# Altium project controller.PrjPcb
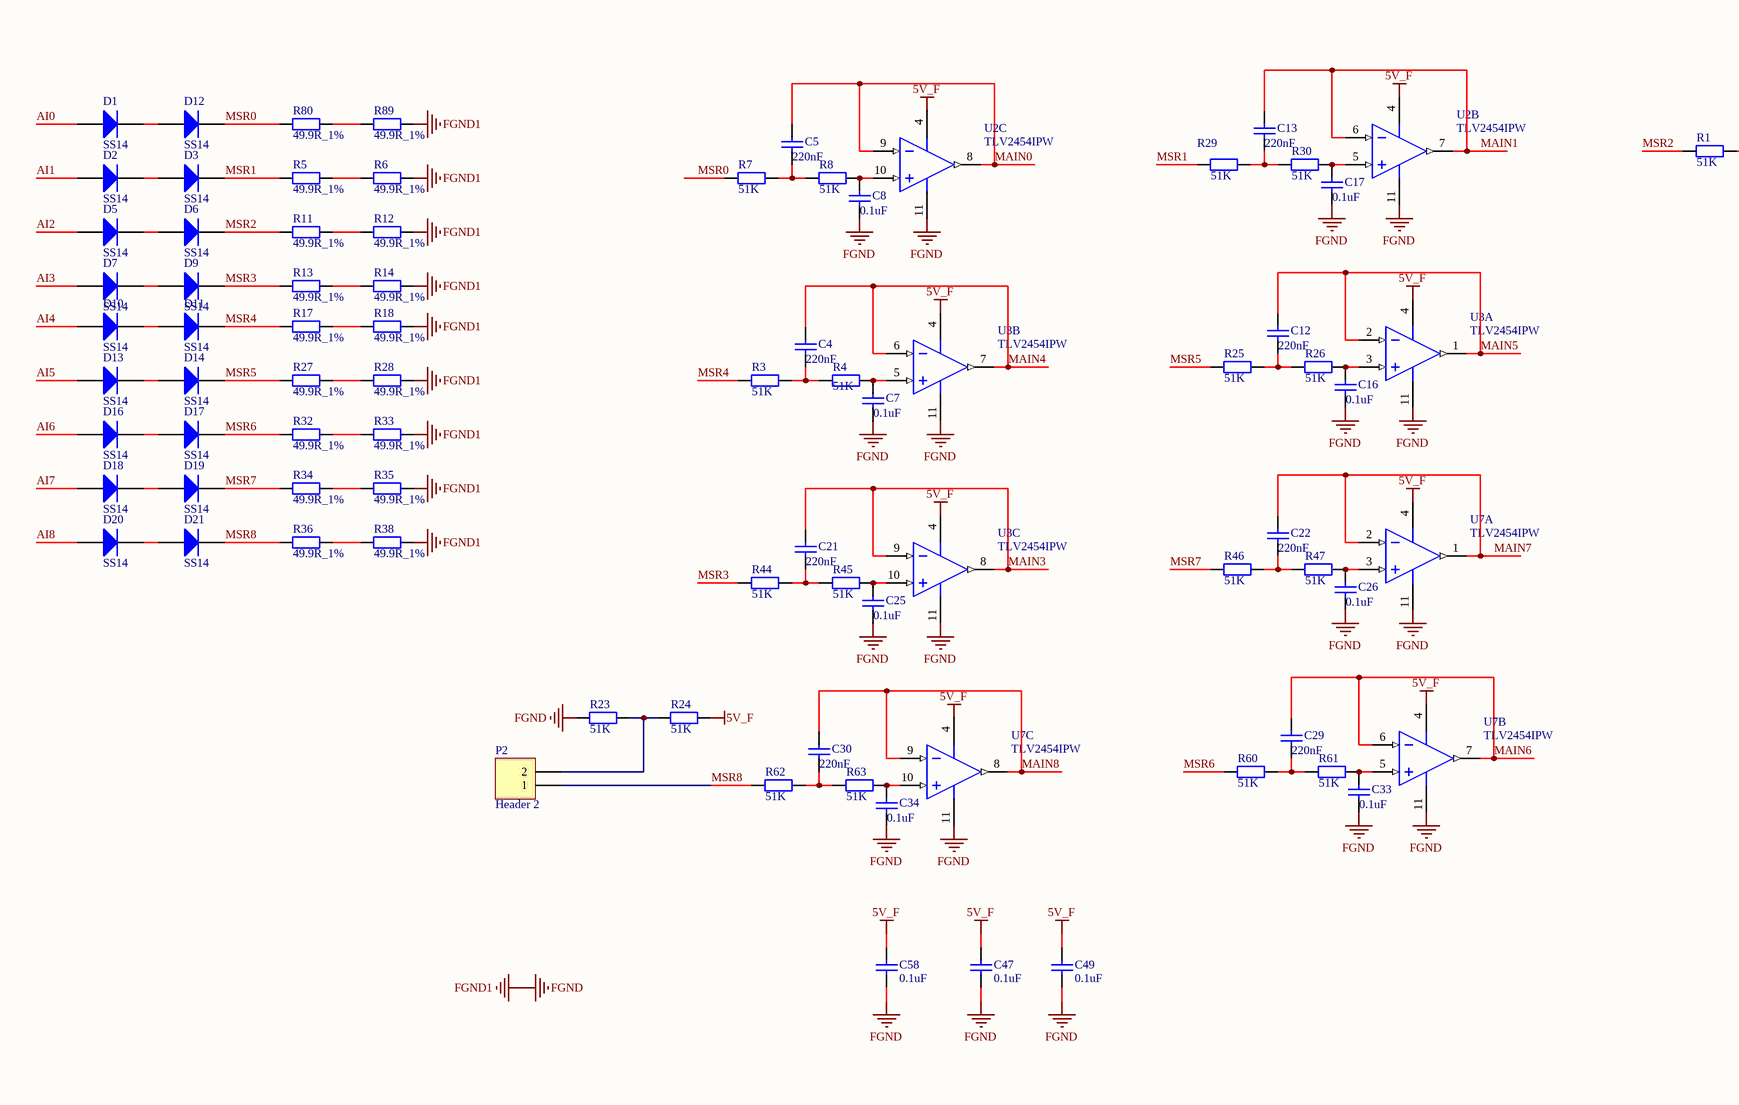
[diagram p0: ai.SchDoc, top left]
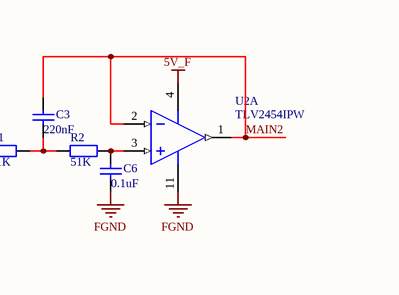
[diagram p1: ai.SchDoc, top right]
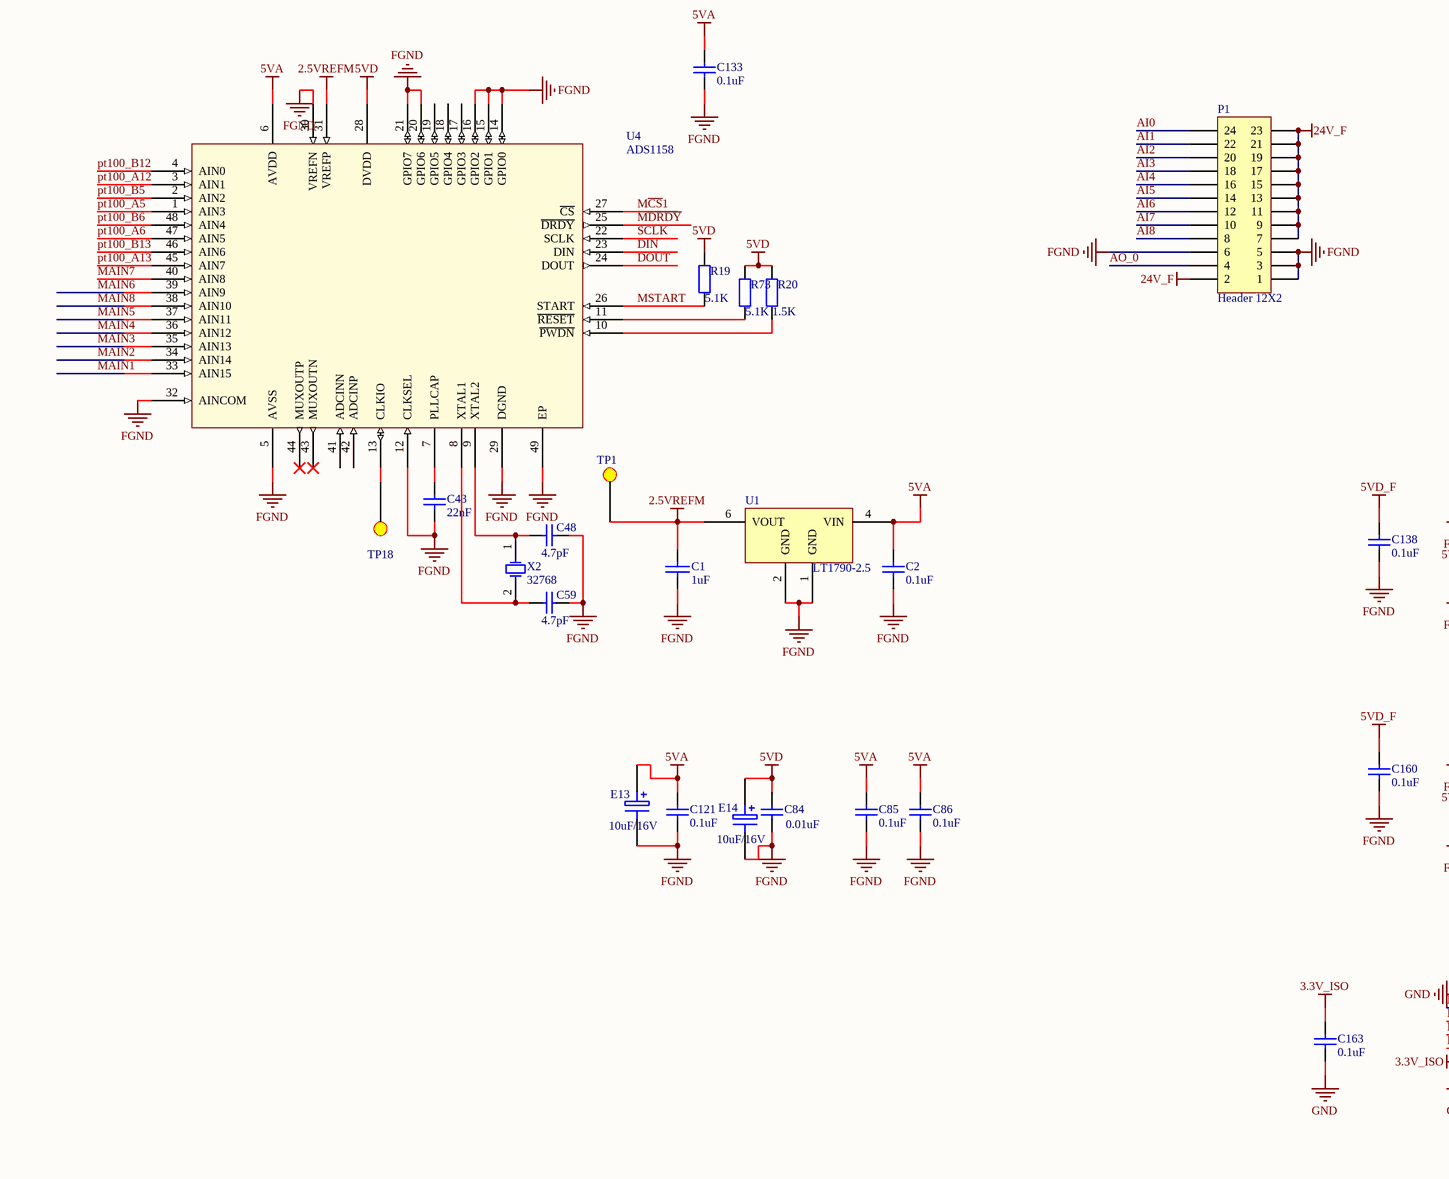
[diagram p2: ai.SchDoc, bottom left]
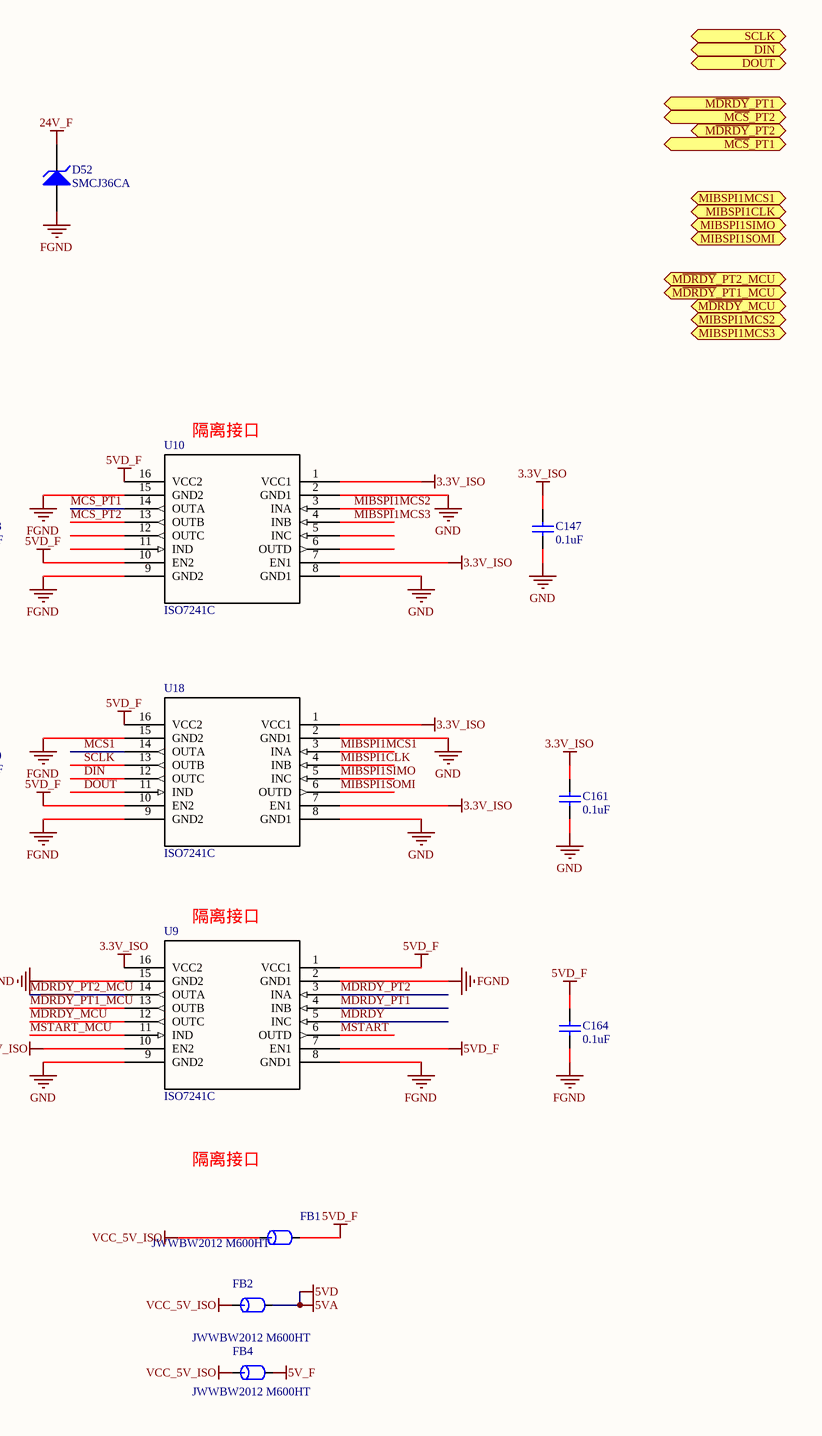
[diagram p3: ai.SchDoc, bottom right]
5 sheets, 231 parts. Net scope: global (net labels, ports and power ports of the same name join across sheets).
Board file: controller_V1.0.PcbDoc
Sheets:
  ai.SchDoc
  ao.SchDoc
  IO_ctrl.SchDoc
  mcu.SchDoc
  pt100.SchDoc

## Sheet ai.SchDoc
size A1

### Parts
C1  1uF  [0603C]
C2  0.1uF  [0603C]
C3  220nF  [0805C]
C4  220nF  [0805C]
C5  220nF  [0805C]
C6  0.1uF  [0603C]
C7  0.1uF  [0603C]
C8  0.1uF  [0603C]
C12  220nF  [0805C]
C13  220nF  [0805C]
C16  0.1uF  [0603C]
C17  0.1uF  [0603C]
C21  220nF  [0805C]
C22  220nF  [0805C]
C25  0.1uF  [0603C]
C26  0.1uF  [0603C]
C29  220nF  [0805C]
C30  220nF  [0805C]
C33  0.1uF  [0603C]
C34  0.1uF  [0603C]
C43  22nF  [0805C]
C47  0.1uF  [0603C]
C48  4.7pF  [0603C]
C49  0.1uF  [0603C]
C58  0.1uF  [0603C]
C59  4.7pF  [0603C]
C84  0.01uF  [0603C]
C85  0.1uF  [0603C]
C86  0.1uF  [0603C]
C121  0.1uF  [0603C]
C133  0.1uF  [0603C]
C138  0.1uF  [0603C]
C147  0.1uF  [0603C]
C160  0.1uF  [0603C]
C161  0.1uF  [0603C]
C163  0.1uF  [0603C]
C164  0.1uF  [0603C]
D1  SS14  [DO-214AC]
D2  SS14  [DO-214AC]
D3  SS14  [DO-214AC]
D5  SS14  [DO-214AC]
D6  SS14  [DO-214AC]
D7  SS14  [DO-214AC]
D9  SS14  [DO-214AC]
D10  SS14  [DO-214AC]
D11  SS14  [DO-214AC]
D12  SS14  [DO-214AC]
D13  SS14  [DO-214AC]
D14  SS14  [DO-214AC]
D16  SS14  [DO-214AC]
D17  SS14  [DO-214AC]
D18  SS14  [DO-214AC]
D19  SS14  [DO-214AC]
D20  SS14  [DO-214AC]
D21  SS14  [DO-214AC]
D52  SMCJ36CA  [SMC]
E13  10uF/16V  [C3528]
E14  10uF/16V  [C3528]
FB1  JWWBW2012 M600HT  [0805R]
FB2  JWWBW2012 M600HT  [0805R]
FB4  JWWBW2012 M600HT  [0805R]
P1  Header 12X2  [XH2.54_2x12]
P2  Header 2  [HDR1X2]
R1  51K  [0603R]
R2  51K  [0603R]
R3  51K  [0603R]
R4  51K  [0603R]
R5  49.9R_1%  [0805R]
R6  49.9R_1%  [0805R]
R7  51K  [0603R]
R8  51K  [0603R]
R11  49.9R_1%  [0805R]
R12  49.9R_1%  [0805R]
R13  49.9R_1%  [0805R]
R14  49.9R_1%  [0805R]
R17  49.9R_1%  [0805R]
R18  49.9R_1%  [0805R]
R19  5.1K  [0603R]
R20  1.5K  [0603R]
R23  51K  [0603R]
R24  51K  [0603R]
R25  51K  [0603R]
R26  51K  [0603R]
R27  49.9R_1%  [0805R]
R28  49.9R_1%  [0805R]
R29  51K  [0603R]
R30  51K  [0603R]
R32  49.9R_1%  [0805R]
R33  49.9R_1%  [0805R]
R34  49.9R_1%  [0805R]
R35  49.9R_1%  [0805R]
R36  49.9R_1%  [0805R]
R38  49.9R_1%  [0805R]
R44  51K  [0603R]
R45  51K  [0603R]
R46  51K  [0603R]
R47  51K  [0603R]
R60  51K  [0603R]
R61  51K  [0603R]
R62  51K  [0603R]
R63  51K  [0603R]
R73  5.1K  [0603R]
R80  49.9R_1%  [0805R]
R89  49.9R_1%  [0805R]
TP1  TEST_POINT  [TPD]  (value not drawn)
TP18  TEST_POINT  [TPD]  (value not drawn)
U1  LT1790-2.5  [SOT23-6]
U2  TLV2454IPW  [TSSOP14]  (parts A,B,C of 4)
U3  TLV2454IPW  [TSSOP14]  (parts A,B,C of 4)
U4  ADS1158  [S-PVFQN-N48]
U7  TLV2454IPW  [TSSOP14]  (parts A,B,C of 4)
U9  ISO7241C  [SOIC16]
U10  ISO7241C  [SOIC16]
U18  ISO7241C  [SOIC16]
X2  32768  [A]

### Ports
DIN (in), DOUT (out), MIBSPI1CLK (in), MIBSPI1MCS1 (in), MIBSPI1MCS2 (in), MIBSPI1MCS3 (in), MIBSPI1SIMO (in), MIBSPI1SOMI (out), M~{CS}_PT1 (out), M~{CS}_PT2 (out), M~{DRDY}_MCU (out), M~{DRDY}_PT1 (out), M~{DRDY}_PT1_MCU (out), M~{DRDY}_PT2 (out), M~{DRDY}_PT2_MCU (out), SCLK (in)

### Nets
2.5VREFM: C1.1 TP1.1 U1.6(VOUT) U4.31(VREFP)
3.3V_ISO: C147.2 C161.2 C163.2 U9.10(EN2) U9.16(VCC2) U10.1(VCC1) U10.7(EN1) U18.1(VCC1) U18.7(EN1)
5V_F: C47.2 C49.2 C58.2 FB4.2 R24.2 U2.4(V+) U3.4(V+) U7.4(V+)
5VA: C2.2 C84.2 C85.2 C86.2 C121.2 C133.2 E13.1 E14.1 FB2.2 R19.1 R20.1 R73.1 U1.4(VIN) U4.6(AVDD) U4.28(DVDD)  [also labelled 5VD]
5VD_F: C138.2 C160.2 C164.2 FB1.2 U9.1(VCC1) U9.7(EN1) U10.10(EN2) U10.16(VCC2) U18.10(EN2) U18.16(VCC2)
24V_F: D52.2(K) P1.2 P1.7 P1.9 P1.11 P1.13 P1.15 P1.17 P1.19 P1.21 P1.23
FGND: C1.2 C2.1 C6.1 C7.1 C8.1 C16.1 C17.1 C25.1 C26.1 C33.1 C34.1 C43.2 C47.1 C48.2 C49.1 C58.1 C59.2 C84.1 C85.1 C86.1 C121.1 C133.1 C138.1 C160.1 C164.1 D52.1(A) E13.2 E14.2 P1.1 P1.3 P1.5 P1.6 R6.1 R12.1 R14.1 R18.1 R23.1 R28.1 R33.1 R35.1 R38.1 R89.1 U1.1(GND) U1.2(GND) U2.11(GND) U3.11(GND) U4.5(AVSS) U4.12(CLKSEL) U4.14(GPIO0) U4.15(GPIO1) U4.16(GPIO2) U4.20(GPIO6) U4.21(GPIO7) U4.29(DGND) U4.30(VREFN) U4.32(AINCOM) U4.49(EP) U7.11(GND) U9.2(GND1) U9.8(GND1) U10.9(GND2) U10.15(GND2) U18.9(GND2) U18.15(GND2)  [also labelled FGND1]
GND: C147.1 C161.1 C163.1 U9.9(GND2) U9.15(GND2) U10.2(GND1) U10.8(GND1) U18.2(GND1) U18.8(GND1)
VCC_5V_ISO: FB1.1 FB2.1 FB4.1
AI0: D1.1(A) P1.24
AI1: D2.1(A) P1.22
AI2: D5.1(A) P1.20
AI3: D7.1(A) P1.18
AI4: D10.1(A) P1.16
AI5: D13.1(A) P1.14
AI6: D16.1(A) P1.12
AI7: D18.1(A) P1.10
AI8: D20.1(A) P1.8
AO_0: P1.4
DIN: U4.23(DIN) U18.12(OUTC)
DOUT: U4.24(DOUT) U18.11(IND)
MAIN0: C5.2 U2.8(OUT) U2.9(IN-)
MAIN1: C13.2 U2.6(IN-) U2.7(OUT) U4.33(AIN15)
MAIN2: C3.2 U2.1(OUT) U2.2(IN-) U4.34(AIN14)
MAIN3: C21.2 U3.8(OUT) U3.9(IN-) U4.35(AIN13)
MAIN4: C4.2 U3.6(IN-) U3.7(OUT) U4.36(AIN12)
MAIN5: C12.2 U3.1(OUT) U3.2(IN-) U4.37(AIN11)
MAIN6: C29.2 U4.39(AIN9) U7.6(IN-) U7.7(OUT)
MAIN7: C22.2 U4.40(AIN8) U7.1(OUT) U7.2(IN-)
MAIN8: C30.2 U4.38(AIN10) U7.8(OUT) U7.9(IN-)
M~{CS}1: U4.27(~{CS}) U18.14(OUTA)
M~{CS}_PT1: U10.14(OUTA)
M~{CS}_PT2: U10.13(OUTB)
M~{DRDY}: U4.25(~{DRDY}) U9.5(INC)
M~{DRDY}_MCU: U9.12(OUTC)
M~{DRDY}_PT1: U9.4(INB)
M~{DRDY}_PT1_MCU: U9.13(OUTB)
M~{DRDY}_PT2: U9.3(INA)
M~{DRDY}_PT2_MCU: U9.14(OUTA)
MIBSPI1CLK: U18.4(INB)
MIBSPI1MCS1: U18.3(INA)
MIBSPI1MCS2: U10.3(INA)
MIBSPI1MCS3: U10.4(INB)
MIBSPI1SIMO: U18.5(INC)
MIBSPI1SOMI: U18.6(OUTD)
MSR0: D12.2(K) R7.2 R80.2
MSR1: D3.2(K) R5.2 R29.2
MSR2: D6.2(K) R1.2 R11.2
MSR3: D9.2(K) R13.2 R44.2
MSR4: D11.2(K) R3.2 R17.2
MSR5: D14.2(K) R25.2 R27.2
MSR6: D17.2(K) R32.2 R60.2
MSR7: D19.2(K) R34.2 R46.2
MSR8: D21.2(K) P2.1 R36.2 R62.2
MSTART: R19.2 U4.26(START) U9.6(OUTD)
MSTART_MCU: U9.11(IND)
pt100_A5: U4.1(AIN3)
pt100_A6: U4.47(AIN5)
pt100_A12: U4.3(AIN1)
pt100_A13: U4.45(AIN7)
pt100_B5: U4.2(AIN2)
pt100_B6: U4.48(AIN4)
pt100_B12: U4.4(AIN0)
pt100_B13: U4.46(AIN6)
SCLK: U4.22(SCLK) U18.13(OUTB)
NetC3_1: C3.1 R1.1 R2.2
NetC4_1: C4.1 R3.1 R4.2
NetC5_1: C5.1 R7.1 R8.2
NetC6_2: C6.2 R2.1 U2.3(IN+)
NetC7_2: C7.2 R4.1 U3.5(IN+)
NetC8_2: C8.2 R8.1 U2.10(IN+)
NetC12_1: C12.1 R25.1 R26.2
NetC13_1: C13.1 R29.1 R30.2
NetC16_2: C16.2 R26.1 U3.3(IN+)
NetC17_2: C17.2 R30.1 U2.5(IN+)
NetC21_1: C21.1 R44.1 R45.2
NetC22_1: C22.1 R46.1 R47.2
NetC25_2: C25.2 R45.1 U3.10(IN+)
NetC26_2: C26.2 R47.1 U7.3(IN+)
NetC29_1: C29.1 R60.1 R61.2
NetC30_1: C30.1 R62.1 R63.2
NetC33_2: C33.2 R61.1 U7.5(IN+)
NetC34_2: C34.2 R63.1 U7.10(IN+)
NetC43_1: C43.1 U4.7(PLLCAP)
NetC48_1: C48.1 U4.9(XTAL2) X2.1(OSC1)
NetC59_1: C59.1 U4.8(XTAL1) X2.2(OSC2)
NetD1_2: D1.2(K) D12.1(A)
NetD2_2: D2.2(K) D3.1(A)
NetD5_2: D5.2(K) D6.1(A)
NetD7_2: D7.2(K) D9.1(A)
NetD10_2: D10.2(K) D11.1(A)
NetD13_2: D13.2(K) D14.1(A)
NetD16_2: D16.2(K) D17.1(A)
NetD18_2: D18.2(K) D19.1(A)
NetD20_2: D20.2(K) D21.1(A)
NetP2_2: P2.2 R23.2 R24.1
NetR5_1: R5.1 R6.2
NetR11_1: R11.1 R12.2
NetR13_1: R13.1 R14.2
NetR17_1: R17.1 R18.2
NetR20_2: R20.2 U4.10(~{PWDN})
NetR27_1: R27.1 R28.2
NetR32_1: R32.1 R33.2
NetR34_1: R34.1 R35.2
NetR36_1: R36.1 R38.2
NetR73_2: R73.2 U4.11(~{RESET})
NetR80_1: R80.1 R89.2
NetTP18_1: TP18.1 U4.13(CLKIO)

Not connected (* = marked no-connect by the designer): U1 3(DNC) 5(DNC); U4 17(GPIO3) 18(GPIO4) 19(GPIO5) 41(ADCINN) 42(ADCINP) 43(MUXOUTN)* 44(MUXOUTP)*; U10 5(INC) 6(OUTD) 11(IND) 12(OUTC)

### Notes on the sheet
- (near U10) 隔离接口
- (near U9) 隔离接口
- 隔离接口

### Library data of the parts
C1 = CAP: Capacitor
C2-C8 C12 C13 C16 C17 C21 C22 C25 C26 C29 C30 C33 C34 C43 C47-C49 C58 C84-C86 C121 C133 C138 C147 C160 C161 C163 C164 = Cap: Capacitor; Published: 8-Jun-2000; LatestRevisionDate: 17-Jul-2002; LatestRevisionNote: Re-released for DXP Platform.; PackageReference: RAD-0.3; Publisher: Altium Limited; PackageDescription: Radial Cap, Thru-Hole; 2 Leads; 0.3 in Pin Spacing
  C2 C47 C49 C58 C85 C86 C121 C133 C138 C147 C160 C161 C163 C164: Value: 0.1uF
C59 = Cap: Capacitor; Value: 6.8pF; Published: 8-Jun-2000; LatestRevisionDate: 17-Jul-2002; LatestRevisionNote: Re-released for DXP Platform.; PackageReference: RAD-0.3; Publisher: Altium Limited; PackageDescription: Radial Cap, Thru-Hole; 2 Leads; 0.3 in Pin Spacing
D1-D3 D5-D7 D9-D14 D16-D21 = Diode: Default Diode; Published: 8-Jun-2000; LatestRevisionDate: 17-Jul-2002; LatestRevisionNote: Re-released for DXP Platform.; PackageVersion: Sep-1996; PackageReference: SMC; Publisher: Altium Limited; Code_JEDEC: DO-214-AB
D52 = D Zener: SMBJ36CA; Published: 8-Jun-2000; LatestRevisionDate: 17-Jul-2002; LatestRevisionNote: Re-released for DXP Platform.; PackageReference: DIODE-0.7; Publisher: Altium Limited
E13 E14 = ELECTRO1: Electrolytic Capacitor
FB1 FB2 FB4 = FB: Part Field 1: 磁珠/0603/1K ohm/100MHz; FB: BLM18BD102SN1(muRata); Text Field1: FB
P1 = Header 12X2: Header, 12-Pin, Dual row; LatestRevisionDate: 17-Jul-2002; LatestRevisionNote: Re-released for DXP Platform.; Publisher: Altium Limited
P2 = Header 2: Header, 2-Pin; LatestRevisionDate: 17-Jul-2002; LatestRevisionNote: Re-released for DXP Platform.; Publisher: Altium Limited
R1-R8 R11-R14 R17-R20 R23-R30 R32-R36 R38 R44-R47 R60-R63 R73 R80 R89 = Res0805M
U1 = LT1790-2.5: 2.5V Micropower SOT-23  Low Dropout Reference
U2 U3 U7 = MAX908EPD: Quad High-speed, Ultra Low-power, Single-Supply TTL comparator; Published: 16-Jan-2001; LatestRevisionDate: 29-May-2009; LatestRevisionNote: Component Body Added.; DatasheetVersion: Jul-1994; PackageVersion: RevB, 21-0043; PackageReference: PD14; Publisher: Altium Limited; PackageDescription: DIP, 14-Pin, Row Spacing 7.62 mm, Pitch 2.54 mm; Code_JEDEC: MS-001-AC; ComponentLink1Description: Manufacturer Link; ComponentLink1URL: http://www.maxim-ic.com/; ComponentLink2Description: Datasheet; ComponentLink2URL: http://pdfserv.maxim-ic.com/en/ds/MAX907-MAX909.pdf
U4 = ADS1158: 16-Channel, 16-Bit Analog-to-Digital Converter
X2 = XTAL: Crystal Oscillator; Published: 8-Jun-2000; LatestRevisionDate: 17-Jul-2002; LatestRevisionNote: Re-released for DXP Platform.; PackageReference: R38; Publisher: Altium Limited

## Sheet ao.SchDoc
size A3
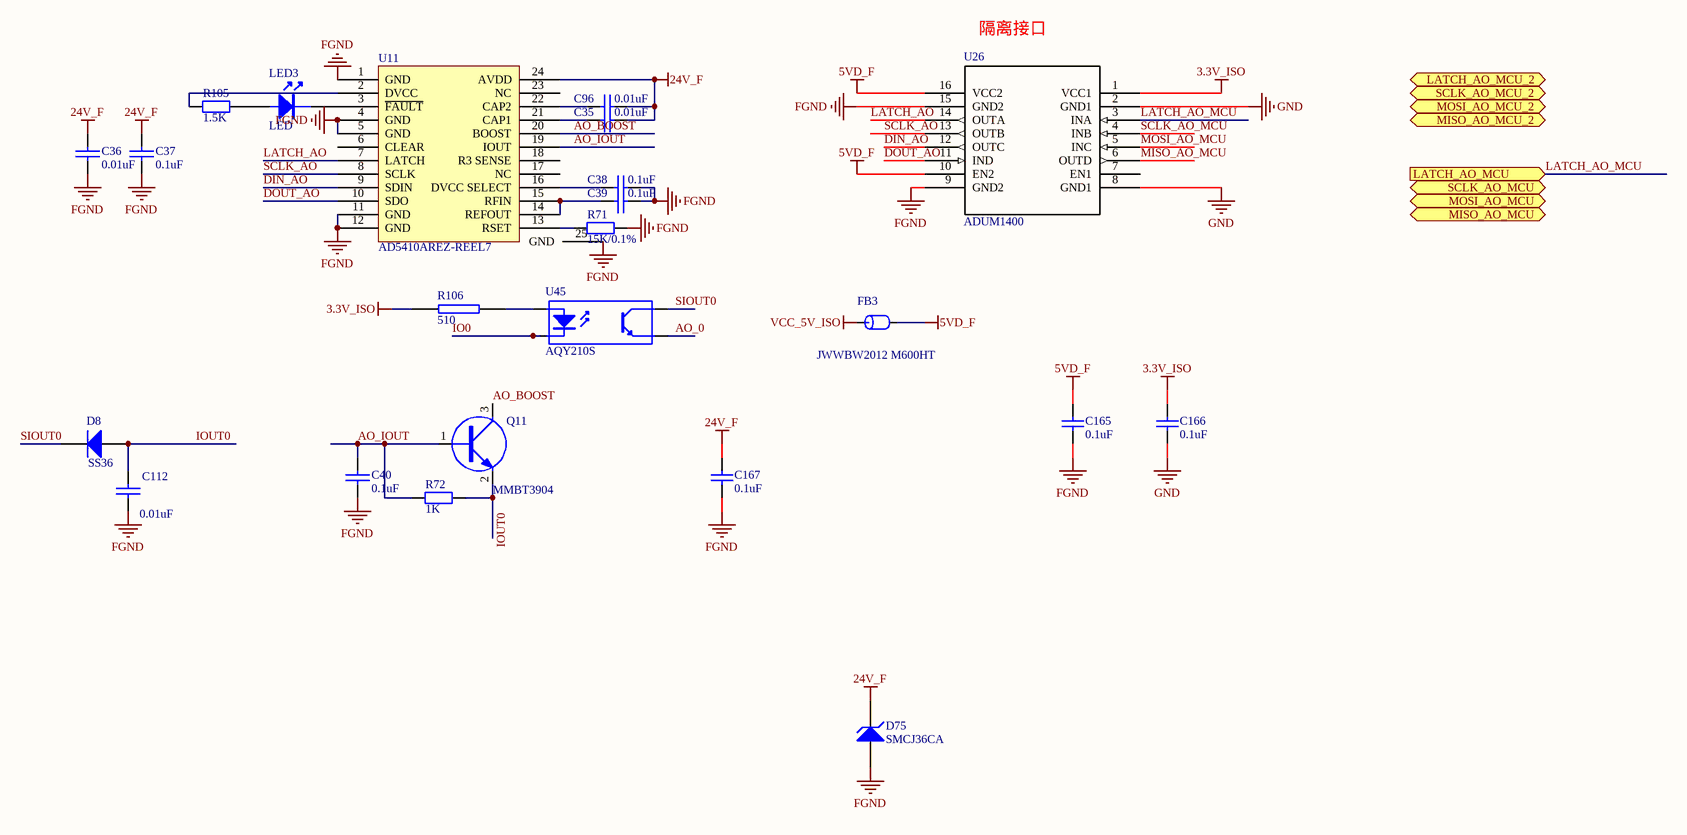
[diagram p4: ao.SchDoc]

### Parts
C35  0.01uF  [0603C]
C36  0.01uF  [0603C]
C37  0.1uF  [0603C]
C38  0.1uF  [0603C]
C39  0.1uF  [0603C]
C40  0.1uF  [0603C]
C96  0.01uF  [0603C]
C112  0.01uF  [0603C]
C165  0.1uF  [0603C]
C166  0.1uF  [0603C]
C167  0.1uF  [0603C]
D8  SS36  [sma]
D75  SMCJ36CA  [SMC]
FB3  JWWBW2012 M600HT  [0805R]
LED3  LED  [0603LED]
Q11  MMBT3904  [SOT23-3]
R71  15K/0.1%  [0603R]
R72  1K  [0603R]
R105  1.5K  [0603R]
R106  510  [0603R]
U11  AD5410AREZ-REEL7  [AD5410AREZ-REEL7]
U26  ADUM1400  [SOIC16]
U45  AQY210S  [sop4]

### Ports
LATCH_AO_MCU (in), LATCH_AO_MCU_2 (in), MISO_AO_MCU (out), MISO_AO_MCU_2 (out), MOSI_AO_MCU (in), MOSI_AO_MCU_2 (in), SCLK_AO_MCU (in), SCLK_AO_MCU_2 (in)

### Nets
3.3V_ISO: C166.2 R106.2 U26.1(VCC1)
5VD_F: C165.2 FB3.2 U26.10(EN2) U26.16(VCC2)
24V_F: C35.2 C36.2 C37.2 C96.2 C167.2 D75.2(K) U11.24(AVDD)
FGND: C36.1 C37.1 C38.2 C39.2 C40.1 C112.1 C165.1 C167.1 D75.1(A) R71.2 U11.1(GND) U11.4(GND) U11.5(GND) U11.11(GND) U11.12(GND) U11.25(GND) U26.9(GND2) U26.15(GND2)
GND: C166.1 U26.2(GND1) U26.8(GND1)
VCC_5V_ISO: FB3.1
AO_0: U45.3(E)
AO_BOOST: Q11.3(C) U11.20(BOOST)
AO_IOUT: C40.2 Q11.1(B) R72.1 U11.19(IOUT)
DIN_AO: U11.9(SDIN) U26.12(OUTC)
DOUT_AO: U11.10(SDO) U26.11(IND)
IO0: U45.2(K)
IOUT0: C112.2 D8.1(A) Q11.2(E) R72.2
LATCH_AO: U11.7(LATCH) U26.14(OUTA)
LATCH_AO_MCU: U26.3(INA) ; port LATCH_AO_MCU
MISO_AO_MCU: U26.6(OUTD)
MOSI_AO_MCU: U26.5(INC)
SCLK_AO: U11.8(SCLK) U26.13(OUTB)
SCLK_AO_MCU: U26.4(INB)
SIOUT0: D8.2(K) U45.4(C)
NetC35_1: C35.1 U11.21(CAP1)
NetC38_1: C38.1 U11.16(DVCC_SELECT)
NetC39_1: C39.1 U11.14(REFOUT) U11.15(RFIN)
NetC96_1: C96.1 U11.22(CAP2)
NetLED3_1: LED3.1 R105.2
NetLED3_2: LED3.2 U11.3(~{FAULT})
NetR71_1: R71.1 U11.13(RSET)
NetR105_1: R105.1 U11.2(DVCC)
NetR106_1: R106.1 U45.1(A)

Not connected (* = marked no-connect by the designer): U11 6(CLEAR) 17(NC) 18(R3_SENSE) 23(NC); U26 7(EN1)

### Notes on the sheet
- 隔离接口

### Library data of the parts
C35-C40 C96 C112 = CAP: Capacitor
C165-C167 = Cap: Capacitor; Published: 8-Jun-2000; LatestRevisionDate: 17-Jul-2002; LatestRevisionNote: Re-released for DXP Platform.; PackageReference: RAD-0.3; Publisher: Altium Limited; PackageDescription: Radial Cap, Thru-Hole; 2 Leads; 0.3 in Pin Spacing; Value: 0.1uF
D8 = Diode 1N4001: 1 Amp General Purpose Rectifier; Published: 8-Jun-2000; LatestRevisionDate: 17-Jul-2002; LatestRevisionNote: Re-released for DXP Platform.; DatasheetVersion: 1998; PackageVersion: Aug-1999; PackageReference: DO-41; Publisher: Altium Limited; Code_JEDEC: DO-204-AL; ComponentLink1Description: Manufacturer Link; ComponentLink1URL: http://www.fairchildsemi.com/; ComponentLink2Description: Datasheet; ComponentLink2URL: http://www.fairchildsemi.com/ds/1N%2F1N4001.pdf
D75 = D Zener: SMBJ36CA; Published: 8-Jun-2000; LatestRevisionDate: 17-Jul-2002; LatestRevisionNote: Re-released for DXP Platform.; PackageReference: DIODE-0.7; Publisher: Altium Limited
FB3 = FB: as FB1 on sheet ai; Text Field1: FB
Q11 = NPN_MMBT3904
R71 R72 R105 = Res0805M
R106 = RES2
U26 = ISO7241C
U45 = Optoisolator1: 4-Pin Phototransistor Optocoupler; Published: 24-Mar-1999; LatestRevisionDate: 04-Mar-2005; LatestRevisionNote: Sch pins 3 & 4 Swapped.; DatasheetVersion: Nov-2003; PackageReference: DIP-4; Publisher: Altium Limited

## Sheet IO_ctrl.SchDoc
size A3
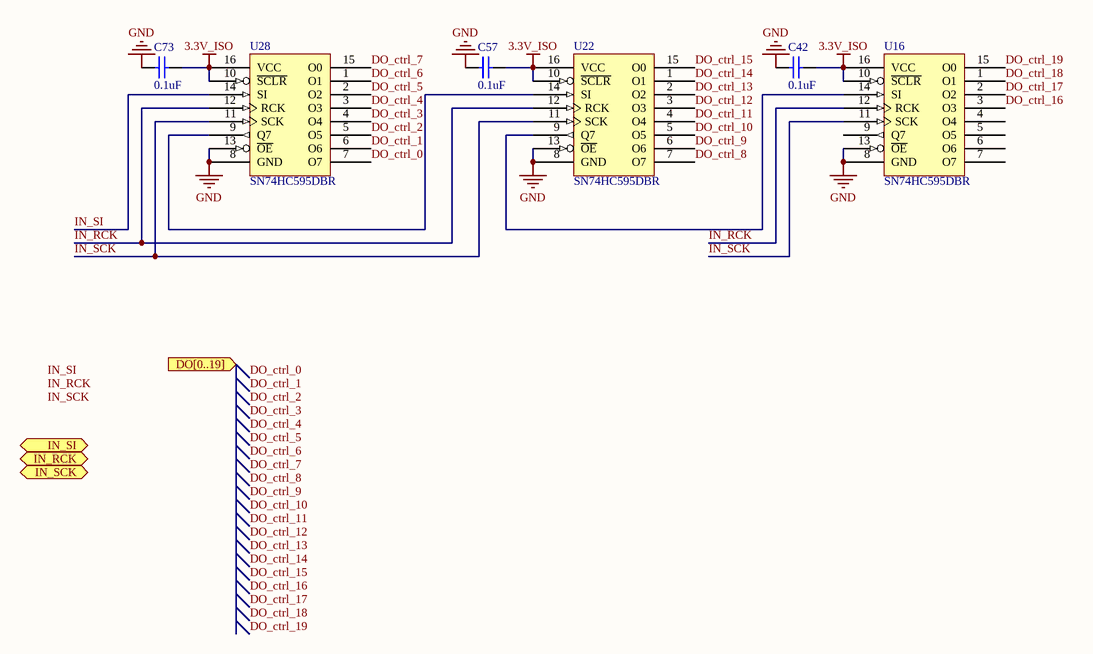
[diagram p5: IO_ctrl.SchDoc]

### Parts
C42  0.1uF  [0603C]
C57  0.1uF  [0603C]
C73  0.1uF  [0603C]
U16  SN74HC595DBR  [SSOP16]
U22  SN74HC595DBR  [SSOP16]
U28  SN74HC595DBR  [SSOP16]

### Ports
DO[0..19] (in), IN_RCK (in), IN_SCK (in), IN_SI (in)

### Nets
3.3V_ISO: C42.1 C57.1 C73.1 U16.10(~{SCLR}) U16.16(VCC) U22.10(~{SCLR}) U22.16(VCC) U28.10(~{SCLR}) U28.16(VCC)
GND: C42.2 C57.2 C73.2 U16.8(GND) U16.13(~{OE}) U22.8(GND) U22.13(~{OE}) U28.8(GND) U28.13(~{OE})
DO_ctrl_0: U28.7(O7)
DO_ctrl_1: U28.6(O6)
DO_ctrl_2: U28.5(O5)
DO_ctrl_3: U28.4(O4)
DO_ctrl_4: U28.3(O3)
DO_ctrl_5: U28.2(O2)
DO_ctrl_6: U28.1(O1)
DO_ctrl_7: U28.15(O0)
DO_ctrl_8: U22.7(O7)
DO_ctrl_9: U22.6(O6)
DO_ctrl_10: U22.5(O5)
DO_ctrl_11: U22.4(O4)
DO_ctrl_12: U22.3(O3)
DO_ctrl_13: U22.2(O2)
DO_ctrl_14: U22.1(O1)
DO_ctrl_15: U22.15(O0)
DO_ctrl_16: U16.3(O3)
DO_ctrl_17: U16.2(O2)
DO_ctrl_18: U16.1(O1)
DO_ctrl_19: U16.15(O0)
IN_RCK: U16.12(RCK) U22.12(RCK) U28.12(RCK)
IN_SCK: U16.11(SCK) U22.11(SCK) U28.11(SCK)
IN_SI: U28.14(SI)
NetU16_14: U16.14(SI) U22.9(Q7)
NetU22_14: U22.14(SI) U28.9(Q7)

Not connected (* = marked no-connect by the designer): U16 4(O4) 5(O5) 6(O6) 7(O7) 9(Q7)

### Notes on the sheet
- Labels drawn without touching a wire or pin: DO_ctrl_0, DO_ctrl_1, DO_ctrl_2, DO_ctrl_3, DO_ctrl_4, DO_ctrl_5, DO_ctrl_6, DO_ctrl_7, DO_ctrl_8, DO_ctrl_9, DO_ctrl_10, DO_ctrl_11, DO_ctrl_12, DO_ctrl_13, DO_ctrl_14, DO_ctrl_15, DO_ctrl_16, DO_ctrl_17, DO_ctrl_18, DO_ctrl_19, IN_RCK, IN_SCK, IN_SI

### Library data of the parts
C42 C57 C73 = Cap: Capacitor; Published: 8-Jun-2000; LatestRevisionDate: 17-Jul-2002; LatestRevisionNote: Re-released for DXP Platform.; PackageReference: RAD-0.3; Publisher: Altium Limited; PackageDescription: Radial Cap, Thru-Hole; 2 Leads; 0.3 in Pin Spacing; Value: 0.1uF
U16 U22 U28 = 74HC595

## Sheet mcu.SchDoc
size A3
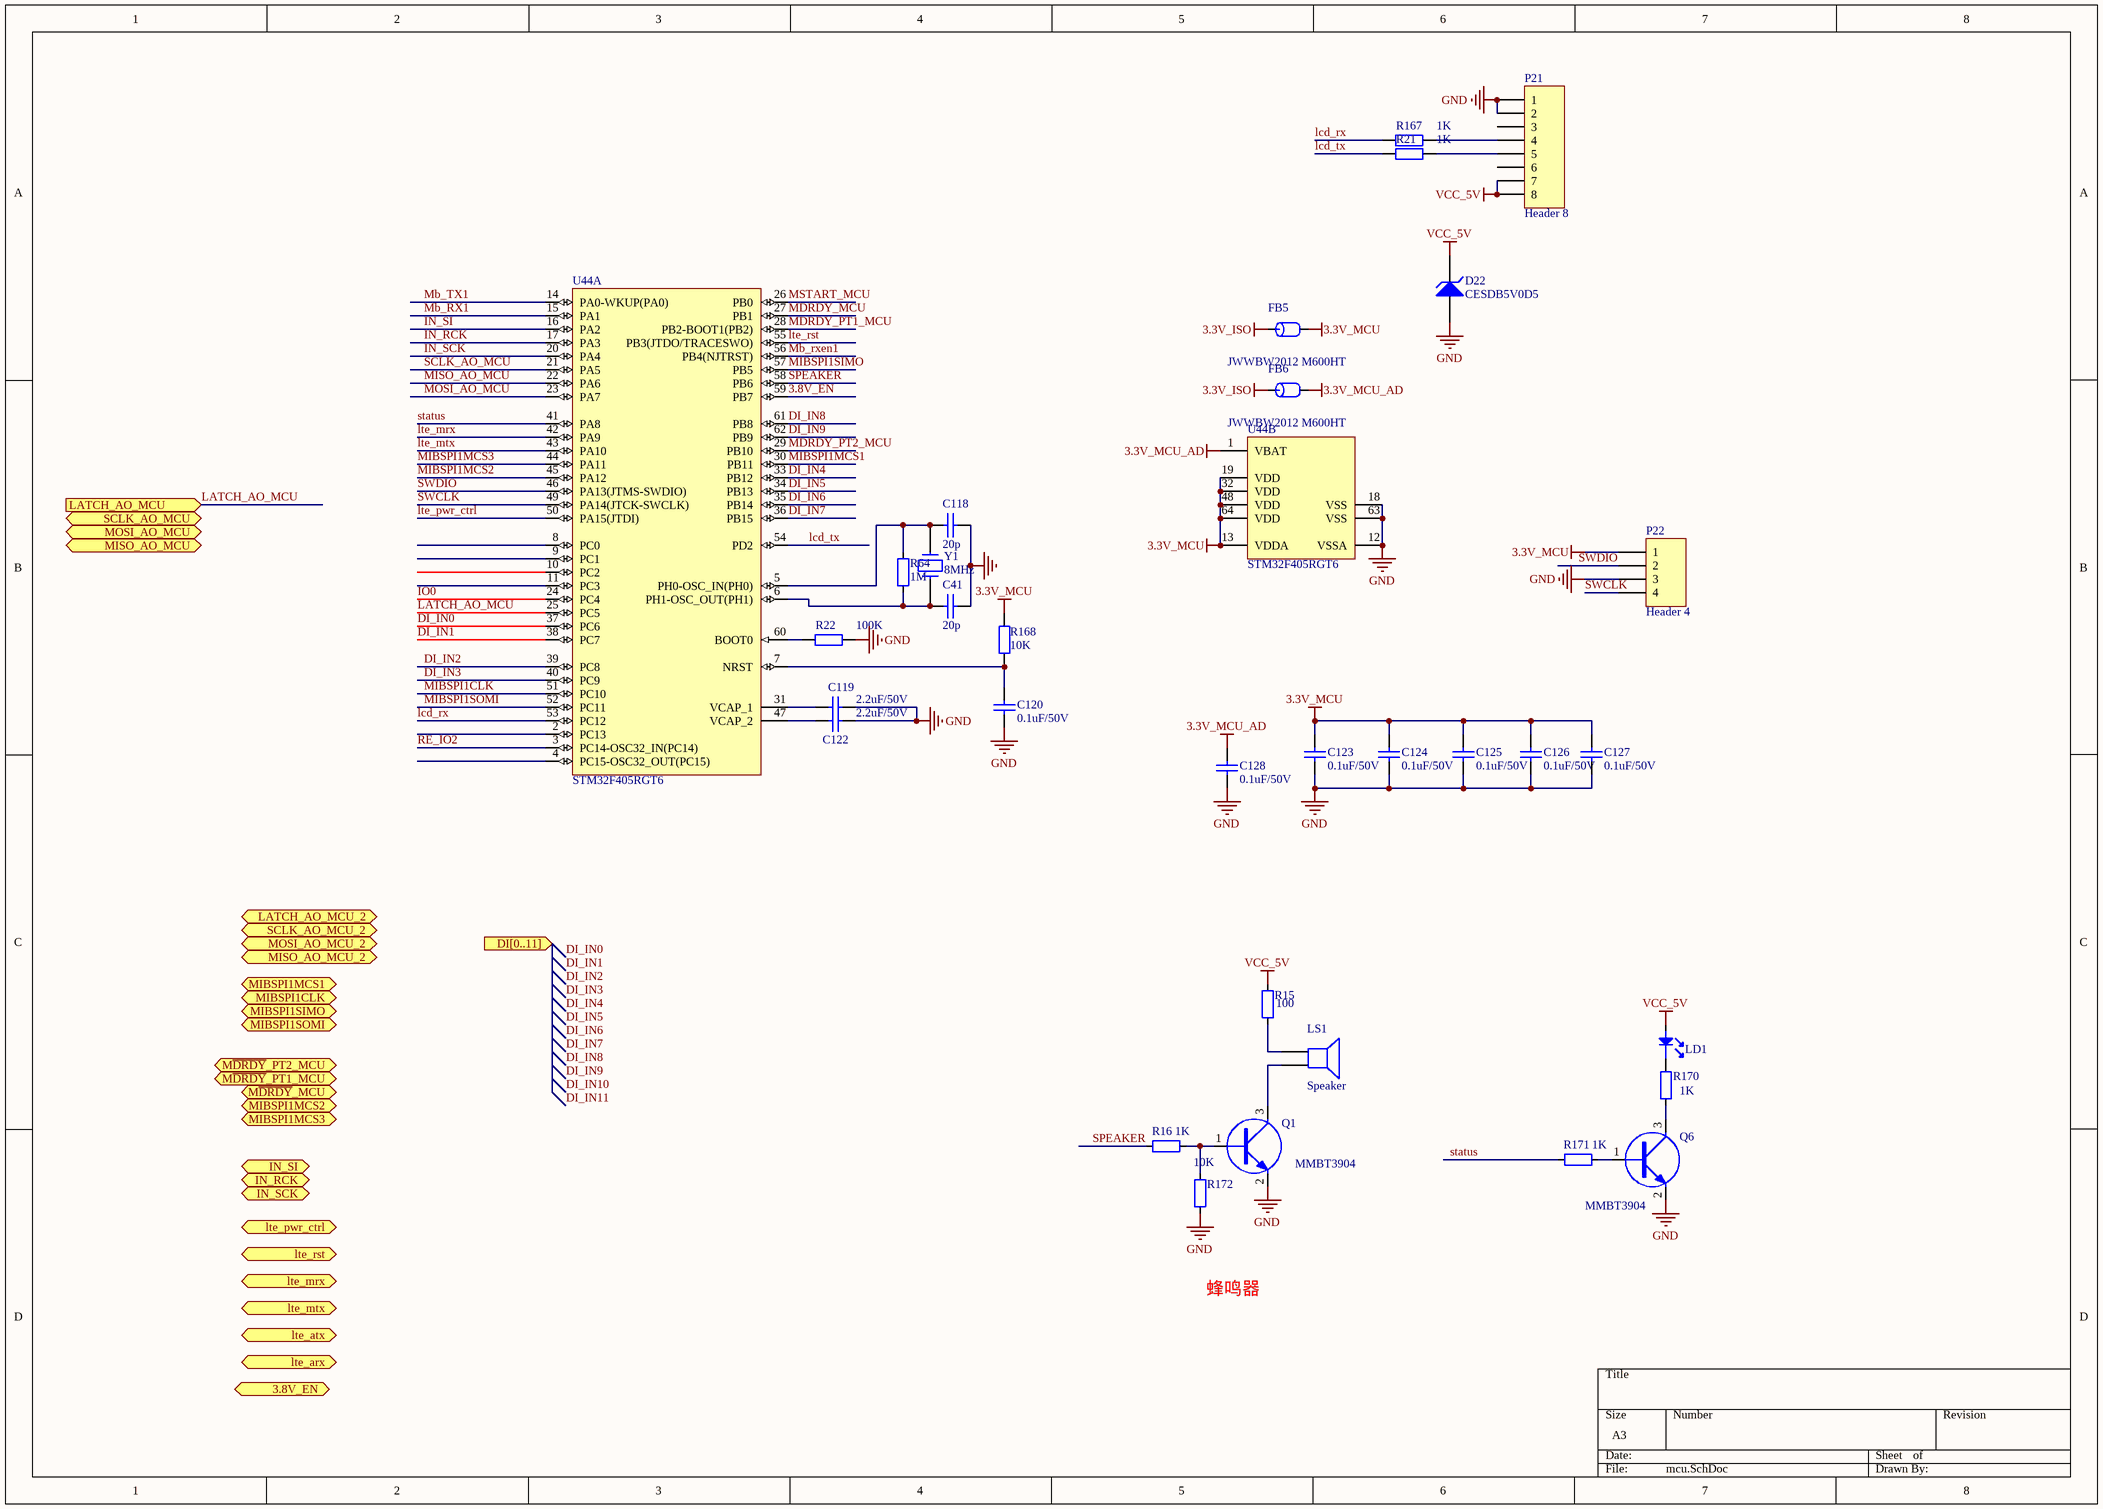
[diagram p6: mcu.SchDoc]

### Parts
C41  20p  [0603c]
C118  20p  [0603c]
C119  2.2uF/50V  [0603C]
C120  0.1uF/50V  [0603C]
C122  2.2uF/50V  [0603C]
C123  0.1uF/50V  [0603C]
C124  0.1uF/50V  [0603C]
C125  0.1uF/50V  [0603C]
C126  0.1uF/50V  [0603C]
C127  0.1uF/50V  [0603C]
C128  0.1uF/50V  [0603C]
D22  CESDB5V0D5  [sod323]
FB5  JWWBW2012 M600HT  [0805R]
FB6  JWWBW2012 M600HT  [0805R]
LD1  LED_Green_19-217  [0603led]  (value not drawn)
LS1  Speaker  [BUFFER_0905]
P21  Header 8  [2.0x8]
P22  Header 4  [HDR1X4]
Q1  MMBT3904  [SOT23-3]
Q6  MMBT3904  [SOT23-3]
R15  100  [0603R]
R16  1K  [0603r]
R21  1K  [0603R]
R22  100K  [0603R]
R64  1M  [0603R]
R167  1K  [0603R]
R168  10K  [0603R]
R170  1K  [0603r]
R171  1K  [0603r]
R172  10K  [0603r]
U44  STM32F405RGT6  [LQFP-64]  (parts A,B of 2)
Y1  8MHz  [CRAY_5032]

### Ports
3.8V_EN (out), DI[0..11] (in), IN_RCK (out), IN_SCK (out), IN_SI (out), LATCH_AO_MCU (in), LATCH_AO_MCU_2 (out), lte_arx (out), lte_atx (in), lte_mrx (out), lte_mtx (in), lte_pwr_ctrl (out), lte_rst (out), MIBSPI1CLK (in), MIBSPI1MCS1 (in), MIBSPI1MCS2 (in), MIBSPI1MCS3 (in), MIBSPI1SIMO (in), MIBSPI1SOMI (out), MISO_AO_MCU (out), MISO_AO_MCU_2 (in), MOSI_AO_MCU (in), MOSI_AO_MCU_2 (out), M~{DRDY}_MCU (out), M~{DRDY}_PT1_MCU (in), M~{DRDY}_PT2_MCU (in), SCLK_AO_MCU (in), SCLK_AO_MCU_2 (out)

### Nets
3.3V_ISO: FB5.1 FB6.1
3.3V_MCU: C123.2 C124.2 C125.2 C126.2 C127.2 FB5.2 P22.1 R168.2 U44.13(VDDA) U44.19(VDD) U44.32(VDD) U44.48(VDD) U44.64(VDD)
3.3V_MCU_AD: C128.2 FB6.2 U44.1(VBAT)
GND: C41.1 C118.1 C119.1 C120.1 C122.1 C123.1 C124.1 C125.1 C126.1 C127.1 C128.1 D22.1(A) P21.1 P21.2 P22.3 Q1.2(E) Q6.2(E) R22.2 R172.2 U44.12(VSSA) U44.18(VSS) U44.63(VSS)
VCC_5V: D22.2(K) LD1.1 P21.7 P21.8 R15.1
3.8V_EN: U44.59(PB7)
DI_IN0: U44.37(PC6)
DI_IN1: U44.38(PC7)
DI_IN2: U44.39(PC8)
DI_IN3: U44.40(PC9)
DI_IN4: U44.33(PB12)
DI_IN5: U44.34(PB13)
DI_IN6: U44.35(PB14)
DI_IN7: U44.36(PB15)
DI_IN8: U44.61(PB8)
DI_IN9: U44.62(PB9)
IN_RCK: U44.17(PA3)
IN_SCK: U44.20(PA4)
IN_SI: U44.16(PA2)
IO0: U44.24(PC4)
LATCH_AO_MCU: U44.25(PC5) ; port LATCH_AO_MCU
lcd_rx: R167.1 U44.53(PC12)
lcd_tx: R21.1 U44.54(PD2)
lte_mrx: U44.42(PA9)
lte_mtx: U44.43(PA10)
lte_pwr_ctrl: U44.50(PA15(JTDI))
lte_rst: U44.55(PB3(JTDO/TRACESWO))
Mb_RX1: U44.15(PA1)
Mb_rxen1: U44.56(PB4(NJTRST))
Mb_TX1: U44.14(PA0-WKUP(PA0))
M~{DRDY}_MCU: U44.27(PB1)
M~{DRDY}_PT1_MCU: U44.28(PB2-BOOT1(PB2))
M~{DRDY}_PT2_MCU: U44.29(PB10)
MIBSPI1CLK: U44.51(PC10)
MIBSPI1MCS1: U44.30(PB11)
MIBSPI1MCS2: U44.45(PA12)
MIBSPI1MCS3: U44.44(PA11)
MIBSPI1SIMO: U44.57(PB5)
MIBSPI1SOMI: U44.52(PC11)
MISO_AO_MCU: U44.22(PA6)
MOSI_AO_MCU: U44.23(PA7)
MSTART_MCU: U44.26(PB0)
RE_IO2: U44.3(PC14-OSC32_IN(PC14))
SCLK_AO_MCU: U44.21(PA5)
SPEAKER: R16.2 U44.58(PB6)
status: R171.1 U44.41(PA8)
SWCLK: P22.4 U44.49(PA14(JTCK-SWCLK))
SWDIO: P22.2 U44.46(PA13(JTMS-SWDIO))
NetC41_2: C41.2 R64.1 U44.6(PH1-OSC_OUT(PH1)) Y1.2
NetC118_2: C118.2 R64.2 U44.5(PH0-OSC_IN(PH0)) Y1.1
NetC119_2: C119.2 U44.31(VCAP_1)
NetC120_2: C120.2 R168.1 U44.7(NRST)
NetC122_2: C122.2 U44.47(VCAP_2)
NetLD1_2: LD1.2 R170.1
NetLS1_1: LS1.1 R15.2
NetLS1_2: LS1.2 Q1.3(C)
NetP21_4: P21.4 R167.2
NetP21_5: P21.5 R21.2
NetQ1_1: Q1.1(B) R16.1 R172.1
NetQ6_1: Q6.1(B) R171.2
NetQ6_3: Q6.3(C) R170.2
NetR22_1: R22.1 U44.60(BOOT0)

Not connected (* = marked no-connect by the designer): P21 3 6; U44 2(PC13) 4(PC15-OSC32_OUT(PC15)) 8(PC0) 9(PC1) 10(PC2) 11(PC3)

### Notes on the sheet
- 蜂鸣器
- Labels drawn without touching a wire or pin: DI_IN0, DI_IN1, DI_IN2, DI_IN3, DI_IN4, DI_IN5, DI_IN6, DI_IN7, DI_IN8, DI_IN9, DI_IN10, DI_IN11

### Library data of the parts
C41 C118 = CAP: Capacitor
C119 C120 C122-C128 = Cap: Capacitor; Value: 22nF; Published: 8-Jun-2000; LatestRevisionDate: 17-Jul-2002; LatestRevisionNote: Re-released for DXP Platform.; PackageReference: RAD-0.3; Publisher: Altium Limited; PackageDescription: Radial Cap, Thru-Hole; 2 Leads; 0.3 in Pin Spacing
D22 = D Zener: Zener Diode; Published: 8-Jun-2000; LatestRevisionDate: 17-Jul-2002; LatestRevisionNote: Re-released for DXP Platform.; PackageReference: DIODE-0.7; Publisher: Altium Limited
FB5 FB6 = FB: as FB1 on sheet ai; Text Field1: FB
LD1 = LED_Green_19-217: 物料主编码(PN): 100000032; Value: 19-217/G7C-AN1P2/3T; ID: 6; 序号: 33; 物料名称: 绿色LED; 物料描述: Other,LED,绿色,0603,1.6X0.8X0.4mm,19-217/G7C-AN1P2/3T; 工作温度: –40°C to 85°C; 制造商: Everlight; 器件等级: ——; 物料类型: 特殊二极管; 规格型号(完整型号): 19-217/G7C-AN1P2/3T
LS1 = Speaker: Loudspeaker; Published: 24-Mar-1999; LatestRevisionDate: 17-Jul-2002; LatestRevisionNote: Re-released for DXP Platform.; PackageReference: PIN2; Publisher: Altium Limited
P21 = Header 8: Header, 8-Pin; LatestRevisionDate: 17-Jul-2002; LatestRevisionNote: Re-released for DXP Platform.; Publisher: Altium Limited
P22 = Header 4: Header, 4-Pin; LatestRevisionDate: 17-Jul-2002; LatestRevisionNote: Re-released for DXP Platform.; Publisher: Altium Limited
Q1 Q6 = NPN_MMBT3904
R15 R16 R64 R170-R172 = RES0603: 物料主编码(PN): 150000040; ID: 233; 序号: 109; 物料名称: 贴片电阻; 精度: ±1%; 规格型号(完整型号): RC1608F103CS/RC0603FR-0710KL; 物料描述: RES,贴片电阻,0603,10k,±1%,1/10W,1.6X0.8X0.45mm,RC1608F103CS/RC0603FR-0710KL; 工作温度: –55°C to 155°C; 制造商: 三星/YAGEO; 器件等级: ——; 物料类型: 表贴电阻; 参数值: 1.00E+04
  R15: Value: 100
  R16 R170 R171: Value: 1K
  R64: Value: 1M
  R172: Value: 10K
R21 R22 R167 R168 = Res0805M
U44 = STM32F405RGT6: ARM Cortex-M4 32-bit MCU+FPU, 210 DMIPS, 1024 kB Flash, 192 kB Internal RAM, 51 I/Os, 64-pin LQFP, -40 to 85 degC, Tray; Manufacturer: STMicroelectronics; D/A Converter: 2x12-bit; FLASH Size (Prog) (kB): 1024; I/Os (High Current): 51; Internal RAM Size (kB): 192; Operating Frequency(F) (Processor speed) (MHz): 168; Supply Voltage(Vcc) max (V): 3.6; Supply Voltage(Vcc) min (V): 1.8; DatasheetVersion: Rev. 4; PackageVersion: Rev. 4, 06/2013; PackageReference: LQFP64; PackageDescription: 64-Pin Low Profile Quad Flat Package, 10 x 10 mm Body, 0.5 mm Pitch; Supplier 1: Digi-Key; Supplier Part Number 1: 497-11767-ND; Supplier 2: Farnell; Supplier Part Number 2: 2064363; Supplier 3: Newark; Supplier Part Number 3: 73T2329; Supplier 4: Mouser; Supplier Part Number 4: 511-STM32F405RGT6; Core: ARM Cortex-M4; Packing: Tray; Mounting Technology: Surface Mount; PartNumber: STM32F405RGT6; ComponentLink1Description: Manufacturer URL; ComponentLink1URL: http://www.st.com/web/en/home.html; ComponentLink2Description: Datasheet; ComponentLink2URL: http://www.st.com/st-web-ui/static/active/en/resource/technical/document/datasheet/DM00037051.pdf; ComponentLink3Description: Package Specification; ComponentLink3URL: http://www.st.com/st-web-ui/static/active/en/resource/technical/document/datasheet/DM00037051.pdf
Y1 = CRYSTAL: HC49S-8MHz

## Sheet pt100.SchDoc
size A2
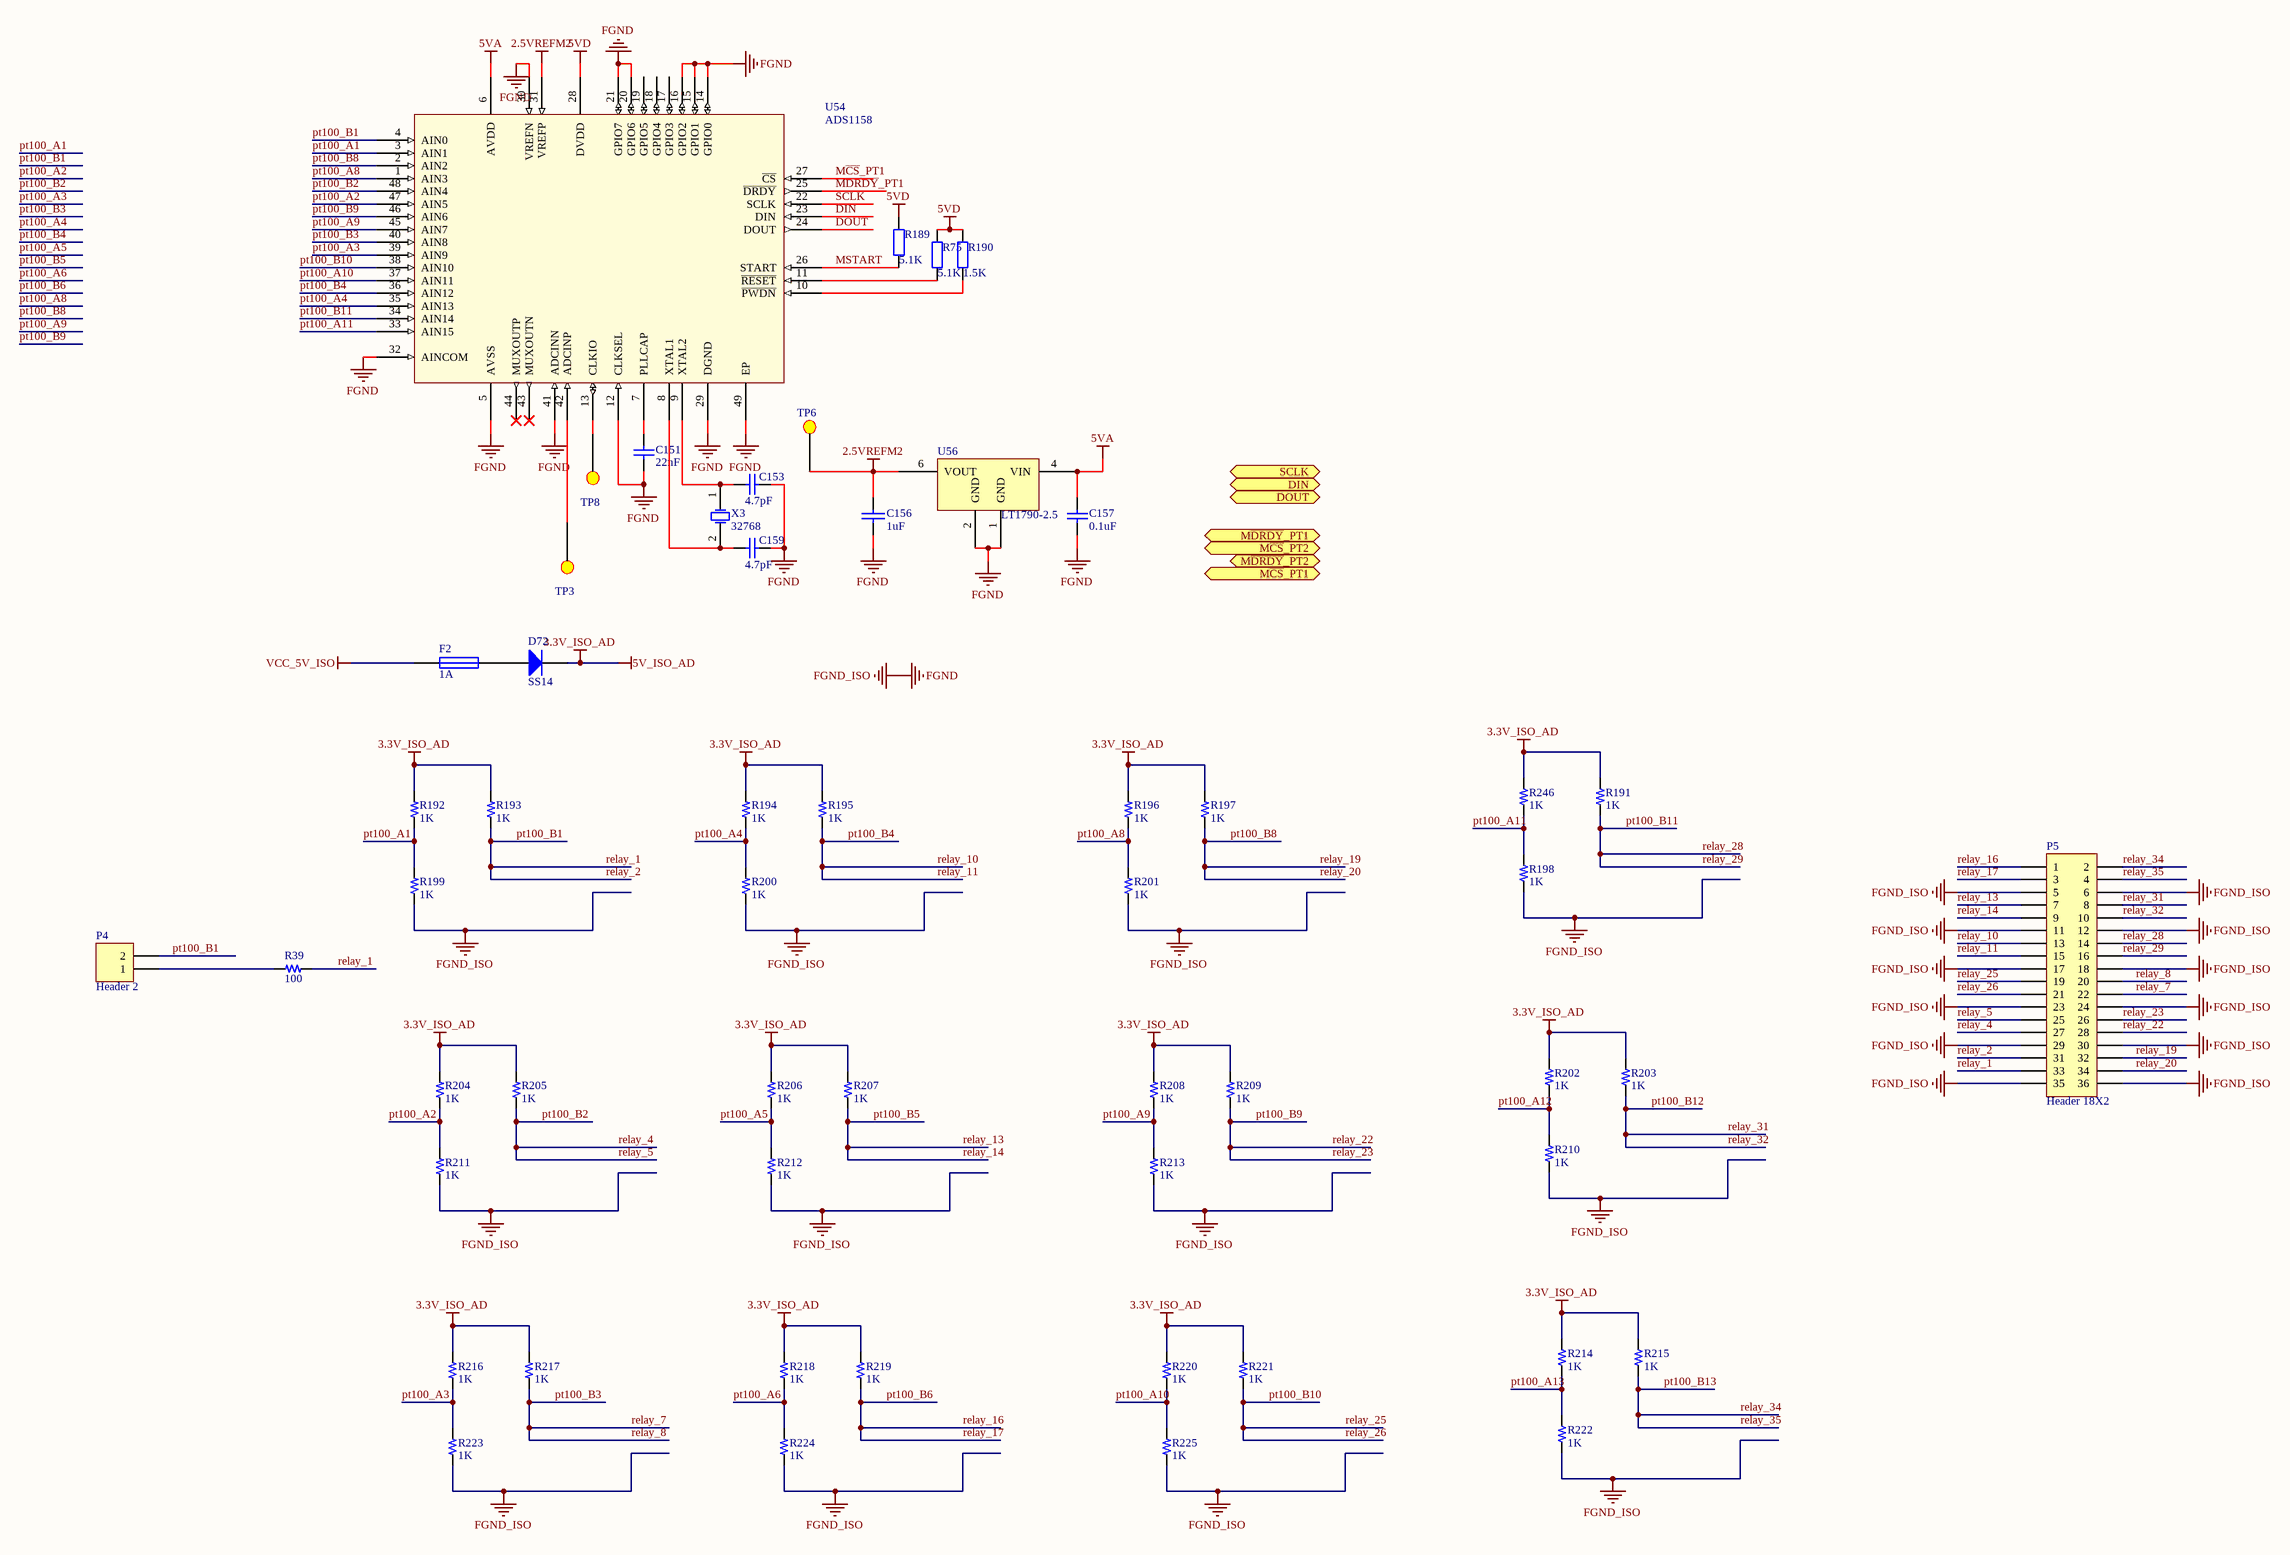
[diagram p7: pt100.SchDoc]

### Parts
C151  22nF  [0805C]
C153  4.7pF  [0603C]
C156  1uF  [0603C]
C157  0.1uF  [0603C]
C159  4.7pF  [0603C]
D72  SS14  [DO-214AC]
F2  1A  [0805r]
P4  Header 2  [HDR1X2]
P5  Header 18X2  [XH2.54_2x18]
R39  100  [0603R]
R75  5.1K  [0603R]
R189  5.1K  [0603R]
R190  1.5K  [0603R]
R191  1K  [0603R]
R192  1K  [0603R]
R193  1K  [0603R]
R194  1K  [0603R]
R195  1K  [0603R]
R196  1K  [0603R]
R197  1K  [0603R]
R198  1K  [0603R]
R199  1K  [0603R]
R200  1K  [0603R]
R201  1K  [0603R]
R202  1K  [0603R]
R203  1K  [0603R]
R204  1K  [0603R]
R205  1K  [0603R]
R206  1K  [0603R]
R207  1K  [0603R]
R208  1K  [0603R]
R209  1K  [0603R]
R210  1K  [0603R]
R211  1K  [0603R]
R212  1K  [0603R]
R213  1K  [0603R]
R214  1K  [0603R]
R215  1K  [0603R]
R216  1K  [0603R]
R217  1K  [0603R]
R218  1K  [0603R]
R219  1K  [0603R]
R220  1K  [0603R]
R221  1K  [0603R]
R222  1K  [0603R]
R223  1K  [0603R]
R224  1K  [0603R]
R225  1K  [0603R]
R246  1K  [0603R]
TP3  TEST_POINT  [TPD]  (value not drawn)
TP6  TEST_POINT  [TPD]  (value not drawn)
TP8  TEST_POINT  [TPD]  (value not drawn)
U54  ADS1158  [S-PVFQN-N48]
U56  LT1790-2.5  [SOT23-6]
X3  32768  [A]

### Ports
DIN (in), DOUT (out), M~{CS}_PT1 (out), M~{CS}_PT2 (out), M~{DRDY}_PT1 (out), M~{DRDY}_PT2 (out), SCLK (in)

### Nets
2.5VREFM2: C156.1 TP6.1 U54.31(VREFP) U56.6(VOUT)
3.3V_ISO_AD: D72.2(K) R191.2 R192.2 R193.2 R194.2 R195.2 R196.2 R197.2 R202.2 R203.2 R204.2 R205.2 R206.2 R207.2 R208.2 R209.2 R214.2 R215.2 R216.2 R217.2 R218.2 R219.2 R220.2 R221.2 R246.2  [also labelled 5V_ISO_AD]
5VA: C157.2 R75.1 R189.1 R190.1 U54.6(AVDD) U54.28(DVDD) U56.4(VIN)  [also labelled 5VD]
FGND: C151.2 C153.2 C156.2 C157.1 C159.2 P5.5 P5.6 P5.11 P5.12 P5.17 P5.18 P5.23 P5.24 P5.29 P5.30 P5.35 P5.36 R198.1 R199.1 R200.1 R201.1 R210.1 R211.1 R212.1 R213.1 R222.1 R223.1 R224.1 R225.1 U54.5(AVSS) U54.12(CLKSEL) U54.14(GPIO0) U54.15(GPIO1) U54.16(GPIO2) U54.20(GPIO6) U54.21(GPIO7) U54.29(DGND) U54.30(VREFN) U54.32(AINCOM) U54.41(ADCINN) U54.49(EP) U56.1(GND) U56.2(GND)  [also labelled FGND_ISO]
VCC_5V_ISO: F2.1
DIN: U54.23(DIN)
DOUT: U54.24(DOUT)
M~{CS}_PT1: U54.27(~{CS})
M~{DRDY}_PT1: U54.25(~{DRDY})
MSTART: R189.2 U54.26(START)
pt100_A1: R192.1 R199.2 U54.3(AIN1)
pt100_A2: R204.1 R211.2 U54.47(AIN5)
pt100_A3: R216.1 R223.2 U54.39(AIN9)
pt100_A4: R194.1 R200.2 U54.35(AIN13)
pt100_A5: R206.1 R212.2
pt100_A6: R218.1 R224.2
pt100_A8: R196.1 R201.2 U54.1(AIN3)
pt100_A9: R208.1 R213.2 U54.45(AIN7)
pt100_A10: R220.1 R225.2 U54.37(AIN11)
pt100_A11: R198.2 R246.1 U54.33(AIN15)
pt100_A12: R202.1 R210.2
pt100_A13: R214.1 R222.2
pt100_B1: P4.2 P5.31 P5.33 R39.1 R193.1 U54.4(AIN0)  [also labelled relay_1, relay_2]
pt100_B2: P5.25 P5.27 R205.1 U54.48(AIN4)  [also labelled relay_4, relay_5]
pt100_B3: P5.20 P5.22 R217.1 U54.40(AIN8)  [also labelled relay_7, relay_8]
pt100_B4: P5.13 P5.15 R195.1 U54.36(AIN12)  [also labelled relay_10, relay_11]
pt100_B5: P5.7 P5.9 R207.1  [also labelled relay_13, relay_14]
pt100_B6: P5.1 P5.3 R219.1  [also labelled relay_16, relay_17]
pt100_B8: P5.32 P5.34 R197.1 U54.2(AIN2)  [also labelled relay_19, relay_20]
pt100_B9: P5.26 P5.28 R209.1 U54.46(AIN6)  [also labelled relay_22, relay_23]
pt100_B10: P5.19 P5.21 R221.1 U54.38(AIN10)  [also labelled relay_25, relay_26]
pt100_B11: P5.14 P5.16 R191.1 U54.34(AIN14)  [also labelled relay_28, relay_29]
pt100_B12: P5.8 P5.10 R203.1  [also labelled relay_31, relay_32]
pt100_B13: P5.2 P5.4 R215.1  [also labelled relay_34, relay_35]
SCLK: U54.22(SCLK)
NetC151_1: C151.1 U54.7(PLLCAP)
NetC153_1: C153.1 U54.9(XTAL2) X3.1(OSC1)
NetC159_1: C159.1 U54.8(XTAL1) X3.2(OSC2)
NetD72_1: D72.1(A) F2.2
NetP4_1: P4.1 R39.2
NetR75_2: R75.2 U54.11(~{RESET})
NetR190_2: R190.2 U54.10(~{PWDN})
NetTP3_1: TP3.1 U54.42(ADCINP)
NetTP8_1: TP8.1 U54.13(CLKIO)

Not connected (* = marked no-connect by the designer): U54 17(GPIO3) 18(GPIO4) 19(GPIO5) 43(MUXOUTN)* 44(MUXOUTP)*; U56 3(DNC) 5(DNC)

### Library data of the parts
C151 C153 C157 = Cap: Capacitor; Published: 8-Jun-2000; LatestRevisionDate: 17-Jul-2002; LatestRevisionNote: Re-released for DXP Platform.; PackageReference: RAD-0.3; Publisher: Altium Limited; PackageDescription: Radial Cap, Thru-Hole; 2 Leads; 0.3 in Pin Spacing
  C157: Value: 0.1uF
C156 = CAP: Capacitor
C159 = Cap: Capacitor; Value: 6.8pF; Published: 8-Jun-2000; LatestRevisionDate: 17-Jul-2002; LatestRevisionNote: Re-released for DXP Platform.; PackageReference: RAD-0.3; Publisher: Altium Limited; PackageDescription: Radial Cap, Thru-Hole; 2 Leads; 0.3 in Pin Spacing
D72 = Diode: Default Diode; Published: 8-Jun-2000; LatestRevisionDate: 17-Jul-2002; LatestRevisionNote: Re-released for DXP Platform.; PackageVersion: Sep-1996; PackageReference: SMC; Publisher: Altium Limited; Code_JEDEC: DO-214-AB
F2 = Fuse 1: Fuse; Published: 8-Jun-2000; LatestRevisionDate: 17-Jul-2002; LatestRevisionNote: Re-released for DXP Platform.; PackageReference: PIN-W2/E2.8; Publisher: Altium Limited; PackageDescription: Thru-Hole; 2 Leads
P4 = Header 2: Header, 2-Pin; LatestRevisionDate: 17-Jul-2002; LatestRevisionNote: Re-released for DXP Platform.; Publisher: Altium Limited
P5 = Header 18X2: Header, 18-Pin, Dual row; LatestRevisionDate: 17-Jul-2002; LatestRevisionNote: Re-released for DXP Platform.; Publisher: Altium Limited
R39 R191-R225 R246 = R
R75 R189 R190 = Res0805M
U54 = ADS1158: as U4 on sheet ai
U56 = LT1790-2.5: as U1 on sheet ai
X3 = XTAL: Crystal Oscillator; Published: 8-Jun-2000; LatestRevisionDate: 17-Jul-2002; LatestRevisionNote: Re-released for DXP Platform.; PackageReference: R38; Publisher: Altium Limited

## Nets that join several sheets
3.3V_ISO: ai (9 pins), ao (C166.2 R106.2 U26.1), IO_ctrl (9 pins), mcu (FB5.1 FB6.1)
5VA: ai (15 pins), pt100 (7 pins)
5VD_F: ai (10 pins), ao (C165.2 FB3.2 U26.10 U26.16)
24V_F: ai (11 pins), ao (7 pins)
FGND: ai (64 pins), ao (18 pins), pt100 (43 pins)
GND: ai (9 pins), ao (C166.1 U26.2 U26.8), IO_ctrl (9 pins), mcu (22 pins)
VCC_5V_ISO: ai (FB1.1 FB2.1 FB4.1), ao (FB3.1), pt100 (F2.1)
AO_0: ai (P1.4), ao (U45.3)
DIN: ai (U4.23 U18.12), pt100 (U54.23)
DOUT: ai (U4.24 U18.11), pt100 (U54.24)
IN_RCK: IO_ctrl (U16.12 U22.12 U28.12), mcu (U44.17)
IN_SCK: IO_ctrl (U16.11 U22.11 U28.11), mcu (U44.20)
IN_SI: IO_ctrl (U28.14), mcu (U44.16)
IO0: ao (U45.2), mcu (U44.24)
LATCH_AO_MCU: ao (U26.3), mcu (U44.25)
M~{CS}_PT1: ai (U10.14), pt100 (U54.27)
M~{DRDY}_MCU: ai (U9.12), mcu (U44.27)
M~{DRDY}_PT1: ai (U9.4), pt100 (U54.25)
M~{DRDY}_PT1_MCU: ai (U9.13), mcu (U44.28)
M~{DRDY}_PT2_MCU: ai (U9.14), mcu (U44.29)
MIBSPI1CLK: ai (U18.4), mcu (U44.51)
MIBSPI1MCS1: ai (U18.3), mcu (U44.30)
MIBSPI1MCS2: ai (U10.3), mcu (U44.45)
MIBSPI1MCS3: ai (U10.4), mcu (U44.44)
MIBSPI1SIMO: ai (U18.5), mcu (U44.57)
MIBSPI1SOMI: ai (U18.6), mcu (U44.52)
MISO_AO_MCU: ao (U26.6), mcu (U44.22)
MOSI_AO_MCU: ao (U26.5), mcu (U44.23)
MSTART: ai (R19.2 U4.26 U9.6), pt100 (R189.2 U54.26)
MSTART_MCU: ai (U9.11), mcu (U44.26)
pt100_A5: ai (U4.1), pt100 (R206.1 R212.2)
pt100_A6: ai (U4.47), pt100 (R218.1 R224.2)
pt100_A12: ai (U4.3), pt100 (R202.1 R210.2)
pt100_A13: ai (U4.45), pt100 (R214.1 R222.2)
pt100_B5: ai (U4.2), pt100 (P5.7 P5.9 R207.1)
pt100_B6: ai (U4.48), pt100 (P5.1 P5.3 R219.1)
pt100_B12: ai (U4.4), pt100 (P5.8 P5.10 R203.1)
pt100_B13: ai (U4.46), pt100 (P5.2 P5.4 R215.1)
SCLK: ai (U4.22 U18.13), pt100 (U54.22)
SCLK_AO_MCU: ao (U26.4), mcu (U44.21)